# Altium schematic sheet NFC_Access_CPU1_R00.SchDoc: NFC Access Board
size A4; Author: Hernan M. Travado; CompanyName: UTN FRBA; Revision: 1.0; SheetNumber: 5; SheetTotal: 7
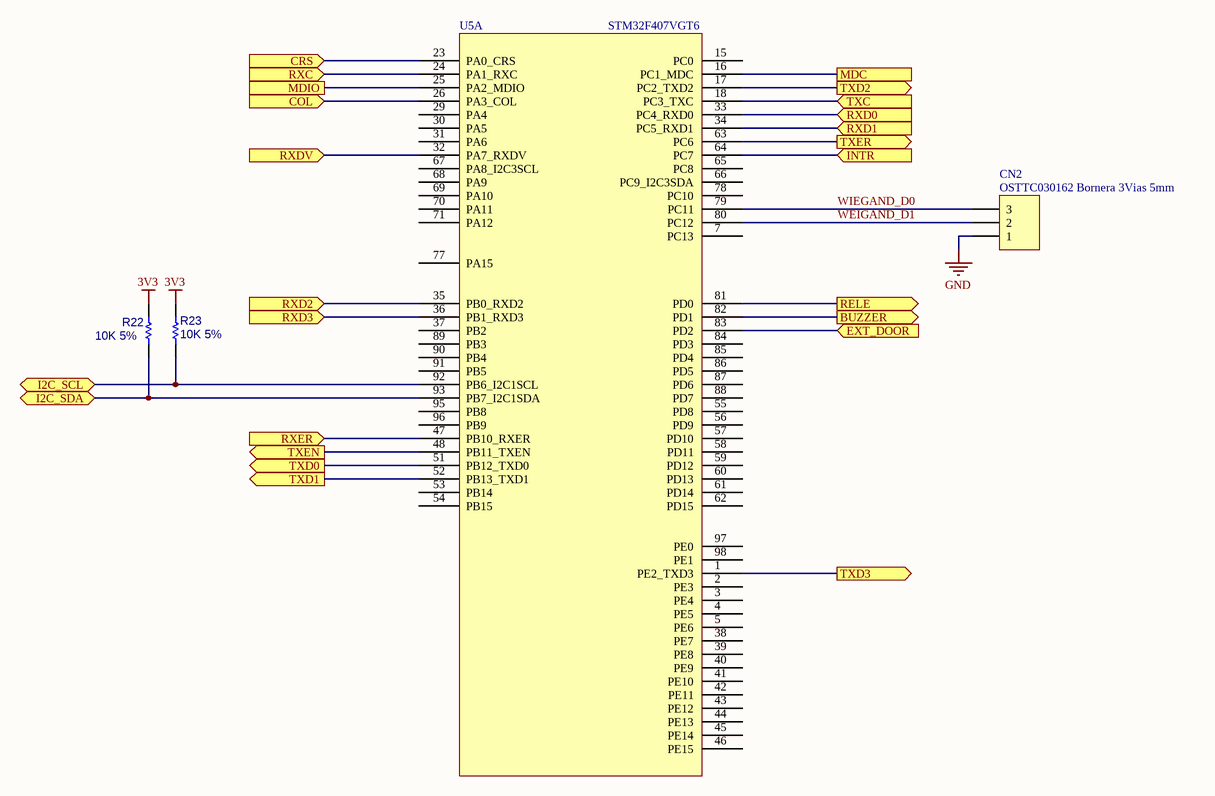
[diagram p0: NFC_Access_CPU1_R00.SchDoc]

## Parts
CN2  OSTTC030162 Bornera 3Vias 5mm  [TerminalBlock_1x3_P5mm]
R22  10K 5%  [R_0603]
R23  10K 5%  [R_0603]
U5  STM32F407VGT6  [LQFP100]  (part A of 2)

## Ports
BUZZER (out, see NFC_Access_MainPage_R00[3C], NFC_Access_IO_R00[1B]), COL (in, see NFC_Access_MainPage_R00[3B], NFC_Access_Ethernet_R00[3A]), CRS (in, see NFC_Access_MainPage_R00[3B], NFC_Access_Ethernet_R00[3A]), EXT_DOOR (in, see NFC_Access_MainPage_R00[3C], NFC_Access_IO_R00[3A]), I2C_SCL (bidir, see NFC_Access_MainPage_R00[3B], NFC_Access_NFC_Reader_R00[4B]), I2C_SDA (bidir, see NFC_Access_MainPage_R00[3B], NFC_Access_NFC_Reader_R00[4B]), INTR (in, see NFC_Access_MainPage_R00[3B], NFC_Access_Ethernet_R00[4B]), MDC (see NFC_Access_MainPage_R00[3B], NFC_Access_Ethernet_R00[4B]), MDIO (see NFC_Access_MainPage_R00[3B], NFC_Access_Ethernet_R00[4B]), RELE (out, see NFC_Access_MainPage_R00[3C], NFC_Access_IO_R00[1D]), RXC (in, see NFC_Access_MainPage_R00[3B], NFC_Access_Ethernet_R00[4D]), RXD0 (in, see NFC_Access_MainPage_R00[3A], NFC_Access_Ethernet_R00[3C]), RXD1 (in, see NFC_Access_MainPage_R00[3B], NFC_Access_Ethernet_R00[3D]), RXD2 (in, see NFC_Access_MainPage_R00[3B], NFC_Access_Ethernet_R00[3D]), RXD3 (in, see NFC_Access_MainPage_R00[3B], NFC_Access_Ethernet_R00[3D]), RXDV (in, see NFC_Access_MainPage_R00[3B], NFC_Access_Ethernet_R00[4D]), RXER (in, see NFC_Access_MainPage_R00[3B], NFC_Access_Ethernet_R00[4C]), TXC (in, see NFC_Access_MainPage_R00[3B], NFC_Access_Ethernet_R00[4A]), TXD0 (out, see NFC_Access_MainPage_R00[3B], NFC_Access_Ethernet_R00[3A]), TXD1 (out, see NFC_Access_MainPage_R00[3B], NFC_Access_Ethernet_R00[3A]), TXD2 (out, see NFC_Access_MainPage_R00[3B], NFC_Access_Ethernet_R00[3A]), TXD3 (out, see NFC_Access_MainPage_R00[3B], NFC_Access_Ethernet_R00[3A]), TXEN (out, see NFC_Access_MainPage_R00[3B], NFC_Access_Ethernet_R00[4A]), TXER (out, see NFC_Access_MainPage_R00[3B], NFC_Access_Ethernet_R00[4A])

## Nets
3V3: R22.2 R23.2
GND: CN2.1
BUZZER: U5.82(PD1) ; port BUZZER
COL: U5.26(PA3_COL) ; port COL
CRS: U5.23(PA0_CRS) ; port CRS
EXT_DOOR: U5.83(PD2) ; port EXT_DOOR
I2C_SCL: R23.1 U5.92(PB6_I2C1SCL) ; port I2C_SCL
I2C_SDA: R22.1 U5.93(PB7_I2C1SDA) ; port I2C_SDA
INTR: U5.64(PC7) ; port INTR
MDC: U5.16(PC1_MDC) ; port MDC
MDIO: U5.25(PA2_MDIO) ; port MDIO
RELE: U5.81(PD0) ; port RELE
RXC: U5.24(PA1_RXC) ; port RXC
RXD0: U5.33(PC4_RXD0) ; port RXD0
RXD1: U5.34(PC5_RXD1) ; port RXD1
RXD2: U5.35(PB0_RXD2) ; port RXD2
RXD3: U5.36(PB1_RXD3) ; port RXD3
RXDV: U5.32(PA7_RXDV) ; port RXDV
RXER: U5.47(PB10_RXER) ; port RXER
TXC: U5.18(PC3_TXC) ; port TXC
TXD0: U5.51(PB12_TXD0) ; port TXD0
TXD1: U5.52(PB13_TXD1) ; port TXD1
TXD2: U5.17(PC2_TXD2) ; port TXD2
TXD3: U5.1(PE2_TXD3) ; port TXD3
TXEN: U5.48(PB11_TXEN) ; port TXEN
TXER: U5.63(PC6) ; port TXER
WEIGAND_D1: CN2.2 U5.80(PC12)
WIEGAND_D0: CN2.3 U5.79(PC11)

Not connected (* = marked no-connect by the designer): U5 2(PE3) 3(PE4) 4(PE5) 5(PE6) 7(PC13) 15(PC0) 29(PA4) 30(PA5) 31(PA6) 37(PB2) 38(PE7) 39(PE8) 40(PE9) 41(PE10) 42(PE11) 43(PE12) 44(PE13) 45(PE14) 46(PE15) 53(PB14) 54(PB15) 55(PD8) 56(PD9) 57(PD10) 58(PD11) 59(PD12) 60(PD13) 61(PD14) 62(PD15) 65(PC8) 66(PC9_I2C3SDA) 67(PA8_I2C3SCL) 68(PA9) 69(PA10) 70(PA11) 71(PA12) 77(PA15) 78(PC10) 84(PD3) 85(PD4) 86(PD5) 87(PD6) 88(PD7) 89(PB3) 90(PB4) 91(PB5) 95(PB8) 96(PB9) 97(PE0) 98(PE1)

## Notes on the sheet
- Title:
- Size:
- Author:
- A4
- Sheet
- of
- Revision:
- File:
- Date:

## Library data of the parts
CN2 = CONN_03P: TERM BLK 3POS SIDE ENTRY 5MM PCB / ED2601-ND
R22 R23 = Res1: Resistor / CR0603-JW-103ELFTR-ND
U5 = STM32F407: Cortex M4 32bit CPU / 497-11605-ND